# Altium schematic sheet CATS-FAT-MCU.SchDoc: CATS Pro
size A4; Author: Luca Jost; Revision: 1.0; SheetNumber: 2; SheetTotal: 13; Subtitle: MCU
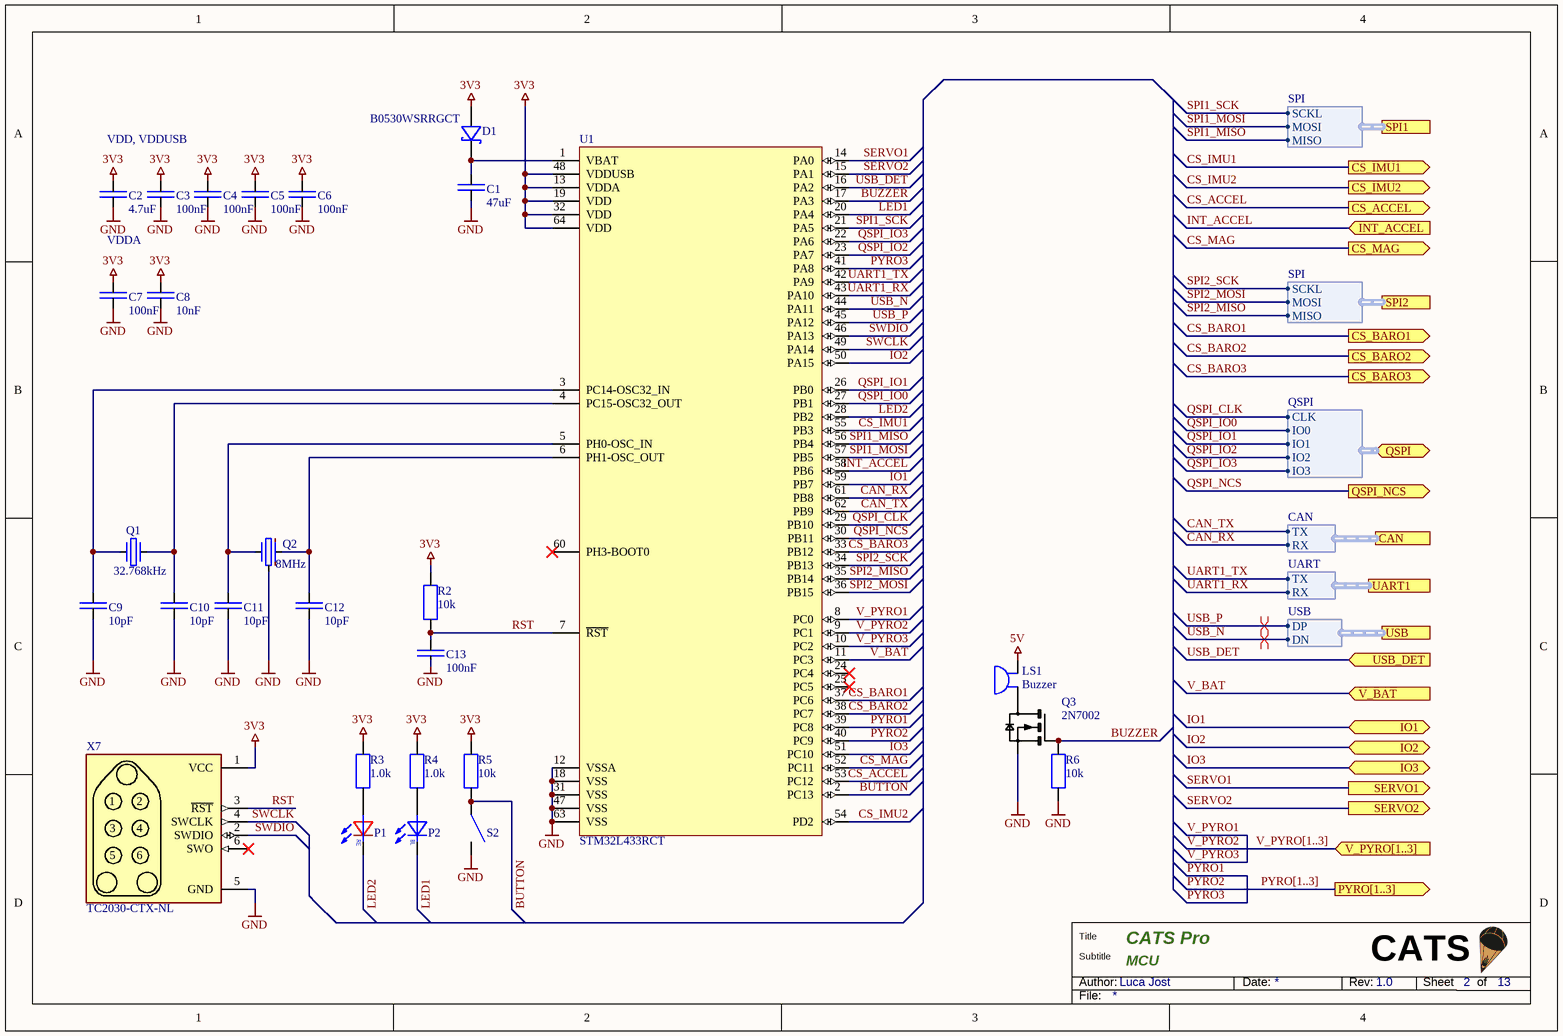
[diagram p0: CATS-FAT-MCU.SchDoc]

## Parts
C1  47uF  [SMD Keramikkondensator 0805]
C2  4.7uF  [SMD Keramikkondensator 0603]
C3  100nF  [SMD Keramikkondensator 0603]
C4  100nF  [SMD Keramikkondensator 0603]
C5  100nF  [SMD Keramikkondensator 0603]
C6  100nF  [SMD Keramikkondensator 0603]
C7  100nF  [SMD Keramikkondensator 0603]
C8  10nF  [SMD Keramikkondensator 0603]
C9  10pF  [SMD Keramikkondensator 0603]
C10  10pF  [SMD Keramikkondensator 0603]
C11  10pF  [SMD Keramikkondensator 0603]
C12  10pF  [SMD Keramikkondensator 0603]
C13  100nF  [SMD Keramikkondensator 0603]
D1  B0530WSRRGCT  [SMD Diode SOD-323F]
LS1  Buzzer  [SMD BUZZER CMT-8504]
P1  LED  [SMD LED 0603]  (value not drawn)
P2  LED  [SMD LED 0603]  (value not drawn)
Q1  32.768kHz  [SMD Crystal 3.2x1.5x0.9]
Q2  8MHz  [SMD Crystal 3.2X2.5X0.8]
Q3  2N7002  [SMD MOSFET SOT-23]
R2  10k  [SMD Widerstand 0603]
R3  1.0k  [SMD Widerstand 0603]
R4  1.0k  [SMD Widerstand 0603]
R5  10k  [SMD Widerstand 0603]
R6  10k  [SMD Widerstand 0603]
S2  SMD-Button  [SMD Button 2.5x3x1.2]  (value not drawn)
U1  STM32L433RCT  [SMD IC LQFP64-N]
X7  TC2030-CTX-NL  [SMD Connector TC2030 w/ holes]  (no BOM)

## Ports
CAN (harness CAN), CS_ACCEL (out), CS_BARO1 (out), CS_BARO2 (out), CS_BARO3 (out), CS_IMU1 (out), CS_IMU2 (out), CS_MAG (out), INT_ACCEL (in), IO1 (bidir), IO2 (bidir), IO3 (bidir), PYRO[1..3] (out), QSPI (bidir, harness QSPI), QSPI_NCS (out), SERVO1 (out), SERVO2 (out), SPI1 (harness SPI), SPI2 (harness SPI), UART1 (harness UART), USB (harness USB), USB_DET (in), V_BAT (in), V_PYRO[1..3] (in)

## Harnesses
SPI: SCKL, MOSI, MISO
QSPI: CLK, IO0, IO1, IO2, IO3
CAN: TX, RX
UART: TX, RX
USB: DP, DN

## Nets
3V3: C2.2 C3.2 C4.2 C5.2 C6.2 C7.2 C8.2 D1.A R2.2 R3.2 R4.2 R5.2 U1.13(VDDA) U1.19(VDD) U1.32(VDD) U1.48(VDDUSB) U1.64(VDD) X7.1(VCC)
5V: LS1.1
GND: C1.1 C2.1 C3.1 C4.1 C5.1 C6.1 C7.1 C8.1 C9.1 C10.1 C11.1 C12.1 C13.1 Q2.3 Q3.S R6.1 S2.2 U1.12(VSSA) U1.18(VSS) U1.31(VSS) U1.47(VSS) U1.63(VSS) X7.5(GND)
BUTTON: R5.1 S2.1 U1.2(PC13)
BUZZER: Q3.G R6.2 U1.17(PA3)
CAN_RX: U1.61(PB8) ; port CAN.RX
CAN_TX: U1.62(PB9) ; port CAN.TX
CS_ACCEL: U1.53(PC12) ; port CS_ACCEL
CS_BARO1: U1.37(PC6) ; port CS_BARO1
CS_BARO2: U1.38(PC7) ; port CS_BARO2
CS_BARO3: U1.33(PB12) ; port CS_BARO3
CS_IMU1: U1.55(PB3) ; port CS_IMU1
CS_IMU2: U1.54(PD2) ; port CS_IMU2
CS_MAG: U1.52(PC11) ; port CS_MAG
INT_ACCEL: U1.58(PB6) ; port INT_ACCEL
IO1: U1.59(PB7) ; port IO1
IO2: U1.50(PA15) ; port IO2
IO3: U1.51(PC10) ; port IO3
LED1: P2.K U1.20(PA4)
LED2: P1.K U1.28(PB2)
PYRO1: U1.39(PC8)
PYRO2: U1.40(PC9)
PYRO3: U1.41(PA8)
QSPI_CLK: U1.29(PB10) ; port QSPI.CLK
QSPI_IO0: U1.27(PB1) ; port QSPI.IO0
QSPI_IO1: U1.26(PB0) ; port QSPI.IO1
QSPI_IO2: U1.23(PA7) ; port QSPI.IO2
QSPI_IO3: U1.22(PA6) ; port QSPI.IO3
QSPI_NCS: U1.30(PB11) ; port QSPI_NCS
RST: C13.2 R2.1 U1.7(~{RST}) X7.3(~{RST})
SERVO1: U1.14(PA0) ; port SERVO1
SERVO2: U1.15(PA1) ; port SERVO2
SPI1_MISO: U1.56(PB4) ; port SPI1.MISO
SPI1_MOSI: U1.57(PB5) ; port SPI1.MOSI
SPI1_SCK: U1.21(PA5) ; port SPI1.SCKL
SPI2_MISO: U1.35(PB14) ; port SPI2.MISO
SPI2_MOSI: U1.36(PB15) ; port SPI2.MOSI
SPI2_SCK: U1.34(PB13) ; port SPI2.SCKL
SWCLK: U1.49(PA14) X7.4(SWCLK)
SWDIO: U1.46(PA13) X7.2(SWDIO)
UART1_RX: U1.43(PA10) ; port UART1.RX
UART1_TX: U1.42(PA9) ; port UART1.TX
USB_DET: U1.16(PA2) ; port USB_DET
USB_N: U1.44(PA11) ; port USB.DN
USB_P: U1.45(PA12) ; port USB.DP
V_BAT: U1.11(PC3) ; port V_BAT
V_PYRO1: U1.8(PC0)
V_PYRO2: U1.9(PC1)
V_PYRO3: U1.10(PC2)
NetC1_2: C1.2 D1.K U1.1(VBAT)
NetC9_2: C9.2 Q1.1 U1.3(PC14-OSC32_IN)
NetC10_2: C10.2 Q1.2 U1.4(PC15-OSC32_OUT)
NetC11_2: C11.2 Q2.1 U1.5(PH0-OSC_IN)
NetC12_2: C12.2 Q2.2 U1.6(PH1-OSC_OUT)
NetLS1_2: LS1.2 Q3.D
NetP1_A: P1.A R3.1
NetP2_A: P2.A R4.1

Not connected (* = marked no-connect by the designer): U1 24(PC4)* 25(PC5)* 60(PH3-BOOT0)*; X7 6(SWO)*

## Buses and harness runs
bus PYRO[1..3] = port PYRO[1..3]
bus V_PYRO[1..3] = port V_PYRO[1..3]

## Layout directives
differential pair: USB_N, USB_P

## Notes on the sheet
- VDD, VDDUSB
- VDDA
- Title
- Author:
- Subtitle
- Date:
- Rev:
- CATS
- Sheet
- of
- File:
- (in symbol LED) BL; RE

## Library data of the parts
C1 = E6 - 47uF: SMD Ceramic Capacitor E6; Unit Price: 0.01; Number: -; Supplier: -
C2 = E6 - 4.7uF: SMD Ceramic Capacitor E6; Unit Price: 0.01; Number: -; Supplier: -
C3-C7 C13 = E6 - 100nF: SMD Ceramic Capacitor E6; Unit Price: 0.01; Number: -; Supplier: -
C8 = E6 - 10nF: SMD Ceramic Capacitor E6; Unit Price: 0.01; Number: -; Supplier: -
C9-C12 = E6 - 10pF: SMD Ceramic Capacitor E6; Unit Price: 0.01; Number: -; Supplier: -
D1 = B0530WSRRGCT: 200mW, 0.47V Schottky Barrier Diode; Digikey: B0530WSRRGCT-ND; ComponentLink1Description: Datasheet; ComponentLink1URL: https://www.taiwansemi.com/products/datasheet/B0530WS_J1709.pdf
LS1 = Buzzer: Buzzers Indicator, Internally Driven Piezo 12V 10mA 3kHz 100dB @ 12V, 10cm Through Hole PC Pins; Digikey: 2104-IP303012-1-ND; ComponentLink1Description: Datasheet; ComponentLink1URL: https://dbunlimitedco.com/images/product_images/2D-Drawings/IP303012-1.pdf
P1 P2 = LED: Color LED
Q1 = Crystal 32.768kHz: CRYSTAL 32.7680KHZ 9PF SMD; Digikey: 2195-CM7VT1ALOWESR32.768KHZ9PF20TAQCTR-ND
Q2 = Crystal: SMD Crystal Resonators 8MHz ±10ppm SMD,3.2x2.5mm; Digikey: 535-15255-1-ND
Q3 = 2N7002: MOSFET N-Channel 20V / 115mA; Item Description: N-Channel MOSFET; Digikey: 2N7002NCT-ND; Price: 0.32; ComponentLink1Description: Datasheet; ComponentLink1URL: https://www.onsemi.com/pub/Collateral/NDS7002A-D.PDF
R2 R5 R6 = E24 - 10k: SMD Chip Resistor E24; Unit Price: 0.01; Number: -; Supplier: -
R3 R4 = E24 - 1.0k: SMD Chip Resistor E24; Unit Price: 0.01; Number: -; Supplier: -
S2 = Button 3mmx2.5mm: Button SPST; LCSC: C128937; Digikey: SW1020TR-ND
U1 = STM32L433RCT: ARM® Cortex®-M4 series Microcontroller IC 32-Bit 80MHz 256KB (256K x 8) FLASH 64-LQFP (10x10); Digikey: 497-17968-ND; ComponentLink1Description: Datasheet; ComponentLink1URL: https://www.st.com/content/ccc/resource/technical/document/datasheet/f7/a0/fc/27/24/4e/4f/3f/DM00257192.pdf/files/DM00257192.pdf/jcr:content/translations/en.DM00257192.pdf
X7 = TC2030-CTX-NL: Tag-Connect for ARM-Cortex (6-Pin)